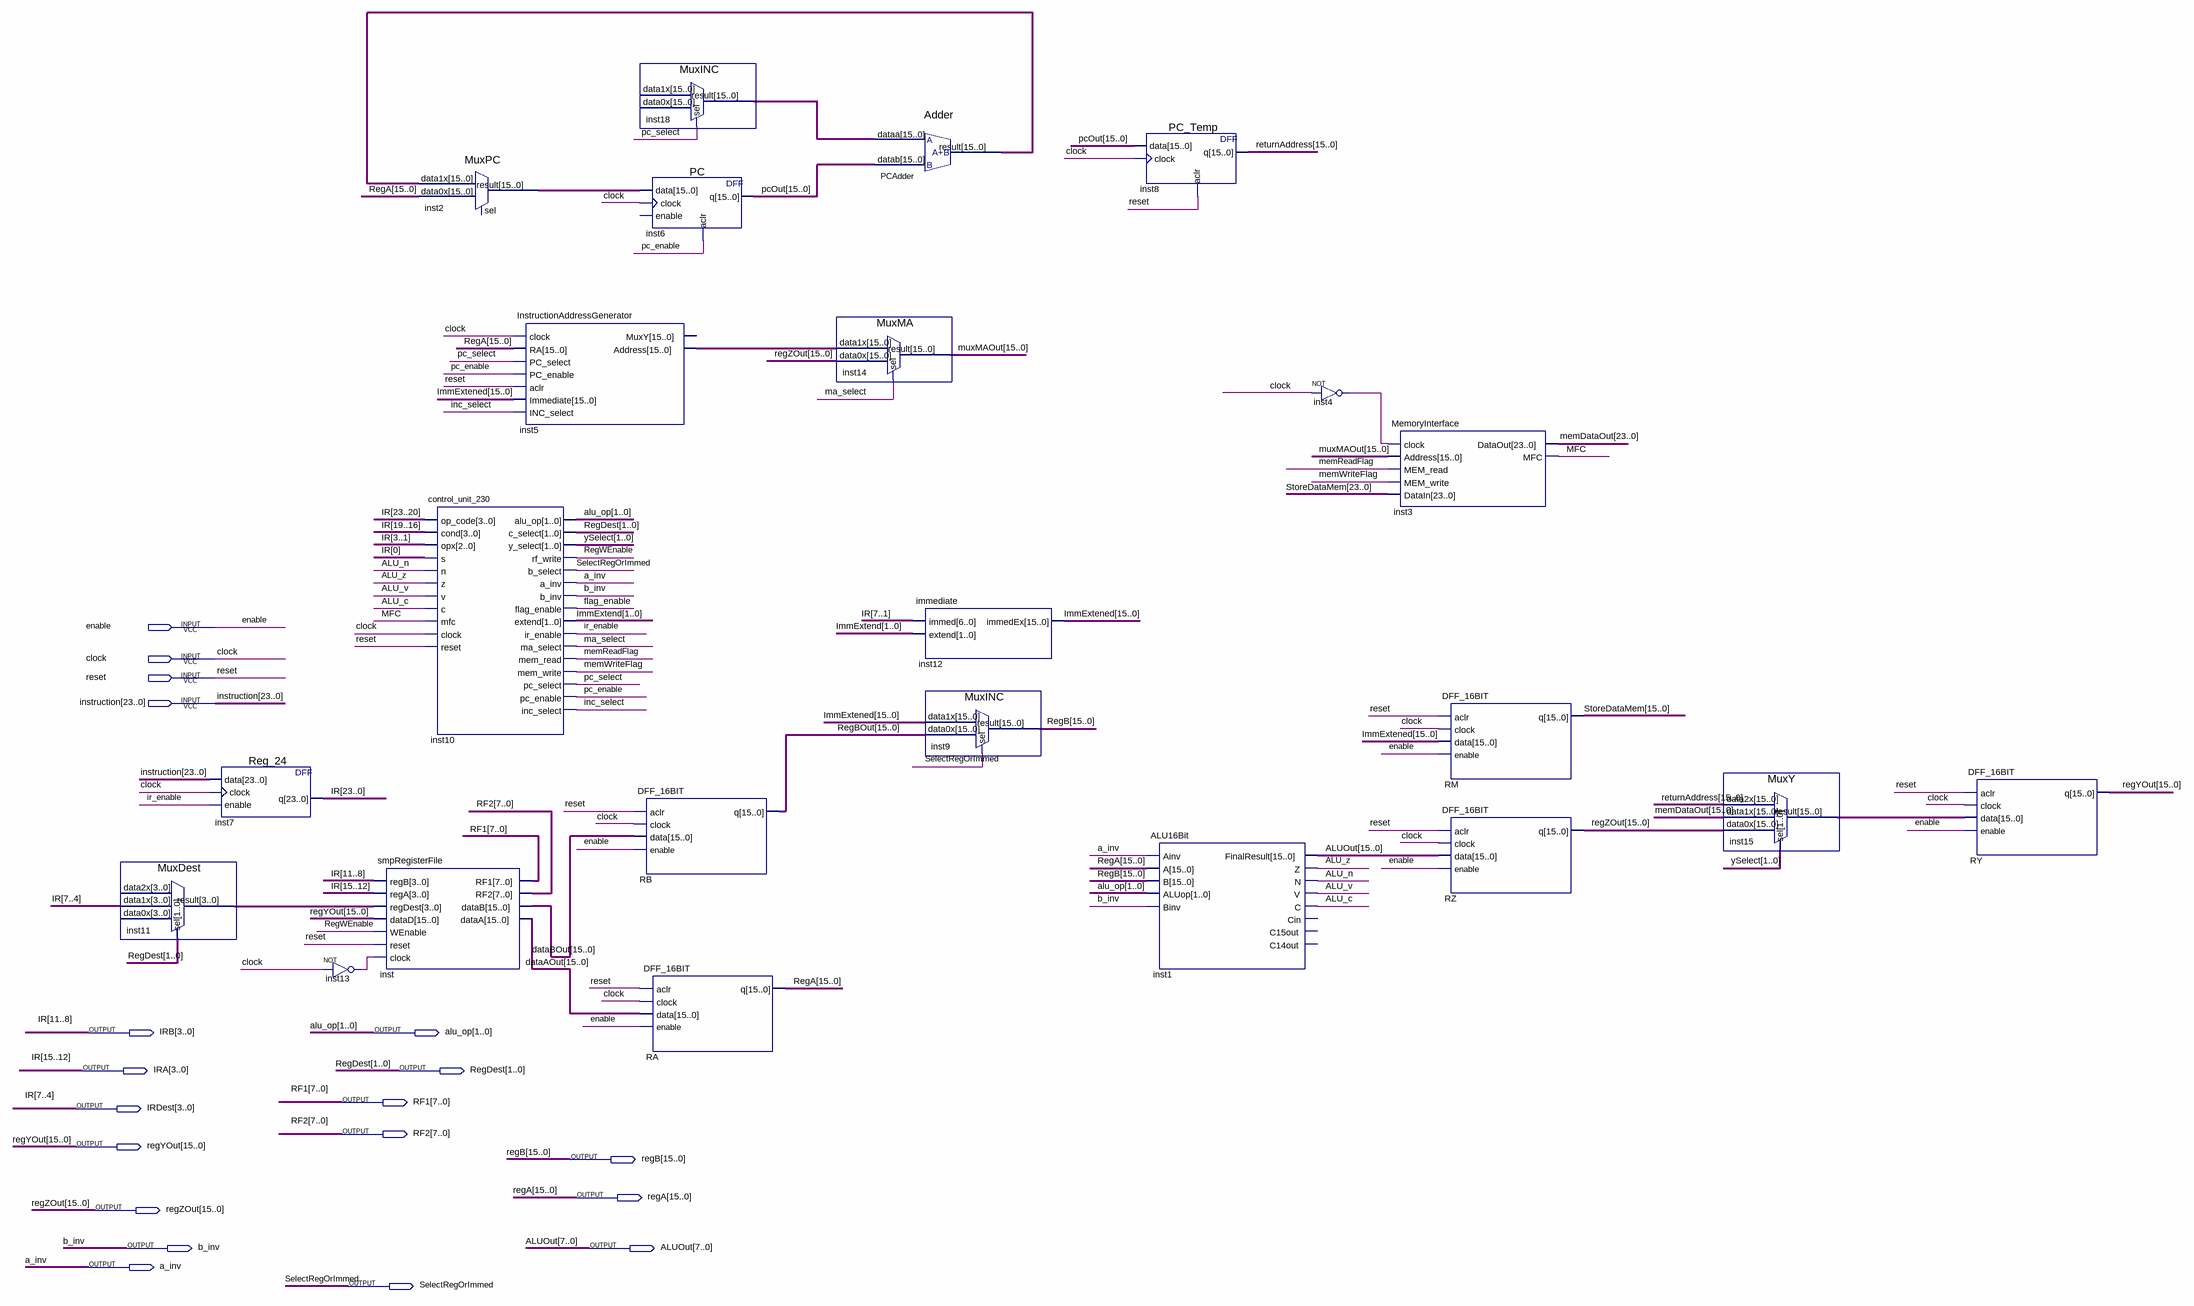
[diagram p0: schematic sheet]
// Quartus schematic ProcessorV1.bdf as structural Verilog: 23 symbols, 19 pins
module ProcessorV1 (
  input  enable,
  input  clock,
  input  reset,
  input  [23:0] instruction,
  output [3:0] IRB,
  output [1:0] alu_op,
  output [3:0] IRA,
  output [1:0] RegDest,
  output [7:0] RF1,
  output [3:0] IRDest,
  output [7:0] RF2,
  output [15:0] regYOut,
  output [15:0] regB,
  output [15:0] regA,
  output [15:0] regZOut,
  output b_inv,
  output [15:0] ALUOut,
  output a_inv,
  output SelectRegOrImmed
);

  wire ALU_c, ALU_n, ALU_v, ALU_z, flag_enable, inc_select, inst4_out, inst13_out, ir_enable, ma_select,
       memReadFlag, memWriteFlag, MFC, pc_enable, pc_select, RegWEnable;
  wire [1:0] ImmExtend, ySelect;
  wire [3:0] inst11_result;
  wire [15:0] dataAOut, dataBOut, ImmExtened, inst2_result, inst5_address, inst15_result, inst18_result,
       muxMAOut, PCAdder_result, pcOut, RegBOut, returnAddress;
  wire [23:0] IR, memDataOut, StoreDataMem;

  MuxDest inst11 (.data1x(IRDest), .sel(RegDest), .result(inst11_result));  // open: data2x, data0x
  Reg_24 inst7 (.data(instruction), .clock(clock), .enable(ir_enable), .q({IR[23:16], IRA, IRB, IRDest, IR[3:0]}));
  not inst13 (inst13_out, clock);
  smpRegisterFile inst (
    .regB(IRB), .regA(IRA), .regDest(inst11_result), .dataD(regYOut), .WEnable(RegWEnable), .reset(reset),
    .clock(inst13_out), .RF1(RF1), .RF2(RF2), .dataB(dataBOut), .dataA(dataAOut));
  MuxPC inst2 (.data1x(PCAdder_result), .data0x(regA), .result(inst2_result));  // open: sel
  control_unit_230 inst10 (
    .op_code(IR[23:20]), .cond(IR[19:16]), .opx(IR[3:1]), .s(IR[0]), .n(ALU_n), .z(ALU_z), .v(ALU_v),
    .c(ALU_c), .mfc(MFC), .clock(clock), .reset(reset), .alu_op(alu_op), .c_select(RegDest),
    .y_select(ySelect), .rf_write(RegWEnable), .b_select(SelectRegOrImmed), .a_inv(a_inv), .b_inv(b_inv),
    .flag_enable(flag_enable), .extend(ImmExtend), .ir_enable(ir_enable), .ma_select(ma_select),
    .mem_read(memReadFlag), .mem_write(memWriteFlag), .pc_select(pc_select), .pc_enable(pc_enable),
    .inc_select(inc_select));
  InstructionAddressGenerator inst5 (
    .clock(clock), .RA(regA), .PC_select(pc_select), .PC_enable(pc_enable), .aclr(reset),
    .Immediate(ImmExtened), .INC_select(inc_select), .Address(inst5_address));  // open: MuxY
  MuxINC inst18 (.sel(pc_select), .result(inst18_result));  // open: data1x, data0x
  PC inst6 (.data(inst2_result), .clock(clock), .aclr(pc_enable), .q(pcOut));  // open: enable
  DFF_16BIT RB (.aclr(reset), .clock(clock), .data(dataBOut), .enable(enable), .q(RegBOut));
  DFF_16BIT RA (.aclr(reset), .clock(clock), .data(dataAOut), .enable(enable), .q(regA));
  MuxMA inst14 (.data1x(inst5_address), .data0x(regZOut), .sel(ma_select), .result(muxMAOut));
  Adder PCAdder (.dataa(inst18_result), .datab(pcOut), .result(PCAdder_result));
  immediate inst12 (.immed({IRDest, IR[3:1]}), .extend(ImmExtend), .immedEx(ImmExtened));
  MuxINC inst9 (.data1x(ImmExtened), .data0x(RegBOut), .sel(SelectRegOrImmed), .result(regB));
  PC_Temp inst8 (.data(pcOut), .clock(clock), .aclr(reset), .q(returnAddress));
  ALU16Bit inst1 (
    .Ainv(a_inv), .A(regA), .B(regB), .ALUop(alu_op), .Binv(b_inv), .FinalResult(ALUOut), .Z(ALU_z),
    .N(ALU_n), .V(ALU_v), .C(ALU_c));  // open: Cin, C15out, C14out
  not inst4 (inst4_out, clock);
  MemoryInterface inst3 (
    .clock(inst4_out), .Address(muxMAOut), .MEM_read(memReadFlag), .MEM_write(memWriteFlag),
    .DataIn(StoreDataMem), .DataOut(memDataOut), .MFC(MFC));
  DFF_16BIT RM (.aclr(reset), .clock(clock), .data(ImmExtened), .enable(enable), .q(StoreDataMem[15:0]));
  DFF_16BIT RZ (.aclr(reset), .clock(clock), .data(ALUOut), .enable(enable), .q(regZOut));
  MuxY inst15 (
    .data2x(returnAddress), .data1x(memDataOut[15:0]), .data0x(regZOut), .sel(ySelect), .result(inst15_result));
  DFF_16BIT RY (.aclr(reset), .clock(clock), .data(inst15_result), .enable(enable), .q(regYOut));

  // Other names for the same wires on the sheet: IR[15:4] = {IRA, IRB, IRDest}
endmodule
